# Altium schematic sheet Headers.SchDoc
size A
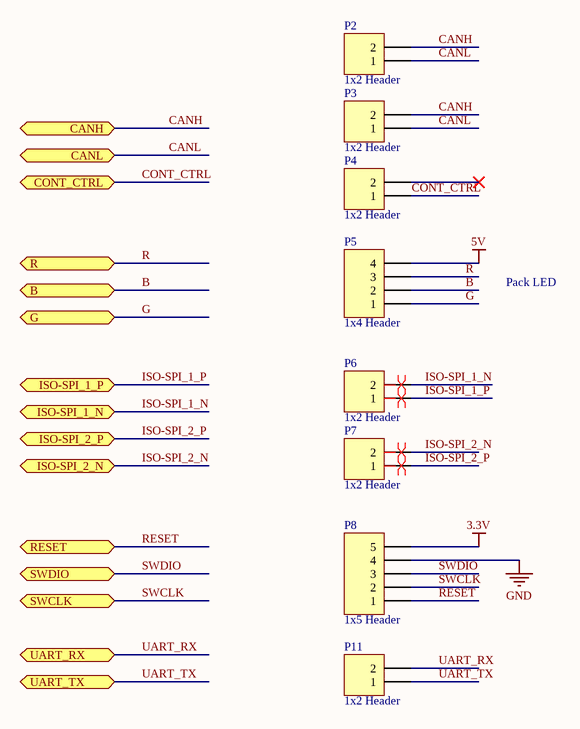
[diagram p0: Headers.SchDoc]

## Parts
P2  1x2 Header  [HDR1X2]
P3  1x2 Header  [HDR1X2]
P4  1x2 Header  [HDR1X2]
P5  1x4 Header  [HDR1X4]
P6  1x2 Header  [HDR1X2]
P7  1x2 Header  [HDR1X2]
P8  1x5 Header  [HDR1X5]
P11  1x2 Header  [HDR1X2]

## Ports
B (bidir), CANH (bidir), CANL (bidir), CONT_CTRL (bidir), G (bidir), ISO-SPI_1_N (bidir), ISO-SPI_1_P (bidir), ISO-SPI_2_N (bidir), ISO-SPI_2_P (bidir), R (bidir), RESET (bidir), SWCLK (bidir), SWDIO (bidir), UART_RX (bidir), UART_TX (bidir)

## Nets
3.3V: P8.5
5V: P5.4
GND: P8.4
B: P5.2 ; port B
CANH: P2.2 P3.2 ; port CANH
CANL: P2.1 P3.1 ; port CANL
CONT_CTRL: P4.1 ; port CONT_CTRL
G: P5.1 ; port G
ISO-SPI_1_N: P6.2 ; port ISO-SPI_1_N
ISO-SPI_1_P: P6.1 ; port ISO-SPI_1_P
ISO-SPI_2_N: P7.2 ; port ISO-SPI_2_N
ISO-SPI_2_P: P7.1 ; port ISO-SPI_2_P
R: P5.3 ; port R
RESET: P8.1 ; port RESET
SWCLK: P8.2 ; port SWCLK
SWDIO: P8.3 ; port SWDIO
UART_RX: P11.2 ; port UART_RX
UART_TX: P11.1 ; port UART_TX

Not connected (* = marked no-connect by the designer): P4 2*

## Layout directives
differential pair: (no net found under the mark)

## Notes on the sheet
- Pack LED

## Library data of the parts
P2-P4 P6 P7 P11 = 1x2 Header: 1x2 Pin Header
P5 = 1x4 Header: 1x4 Pin Header
P8 = 1x5 Header: 1x5 Pin Header